# EAGLE design DeadHorsePCB_REV-A (EAGLE 8.3.1)
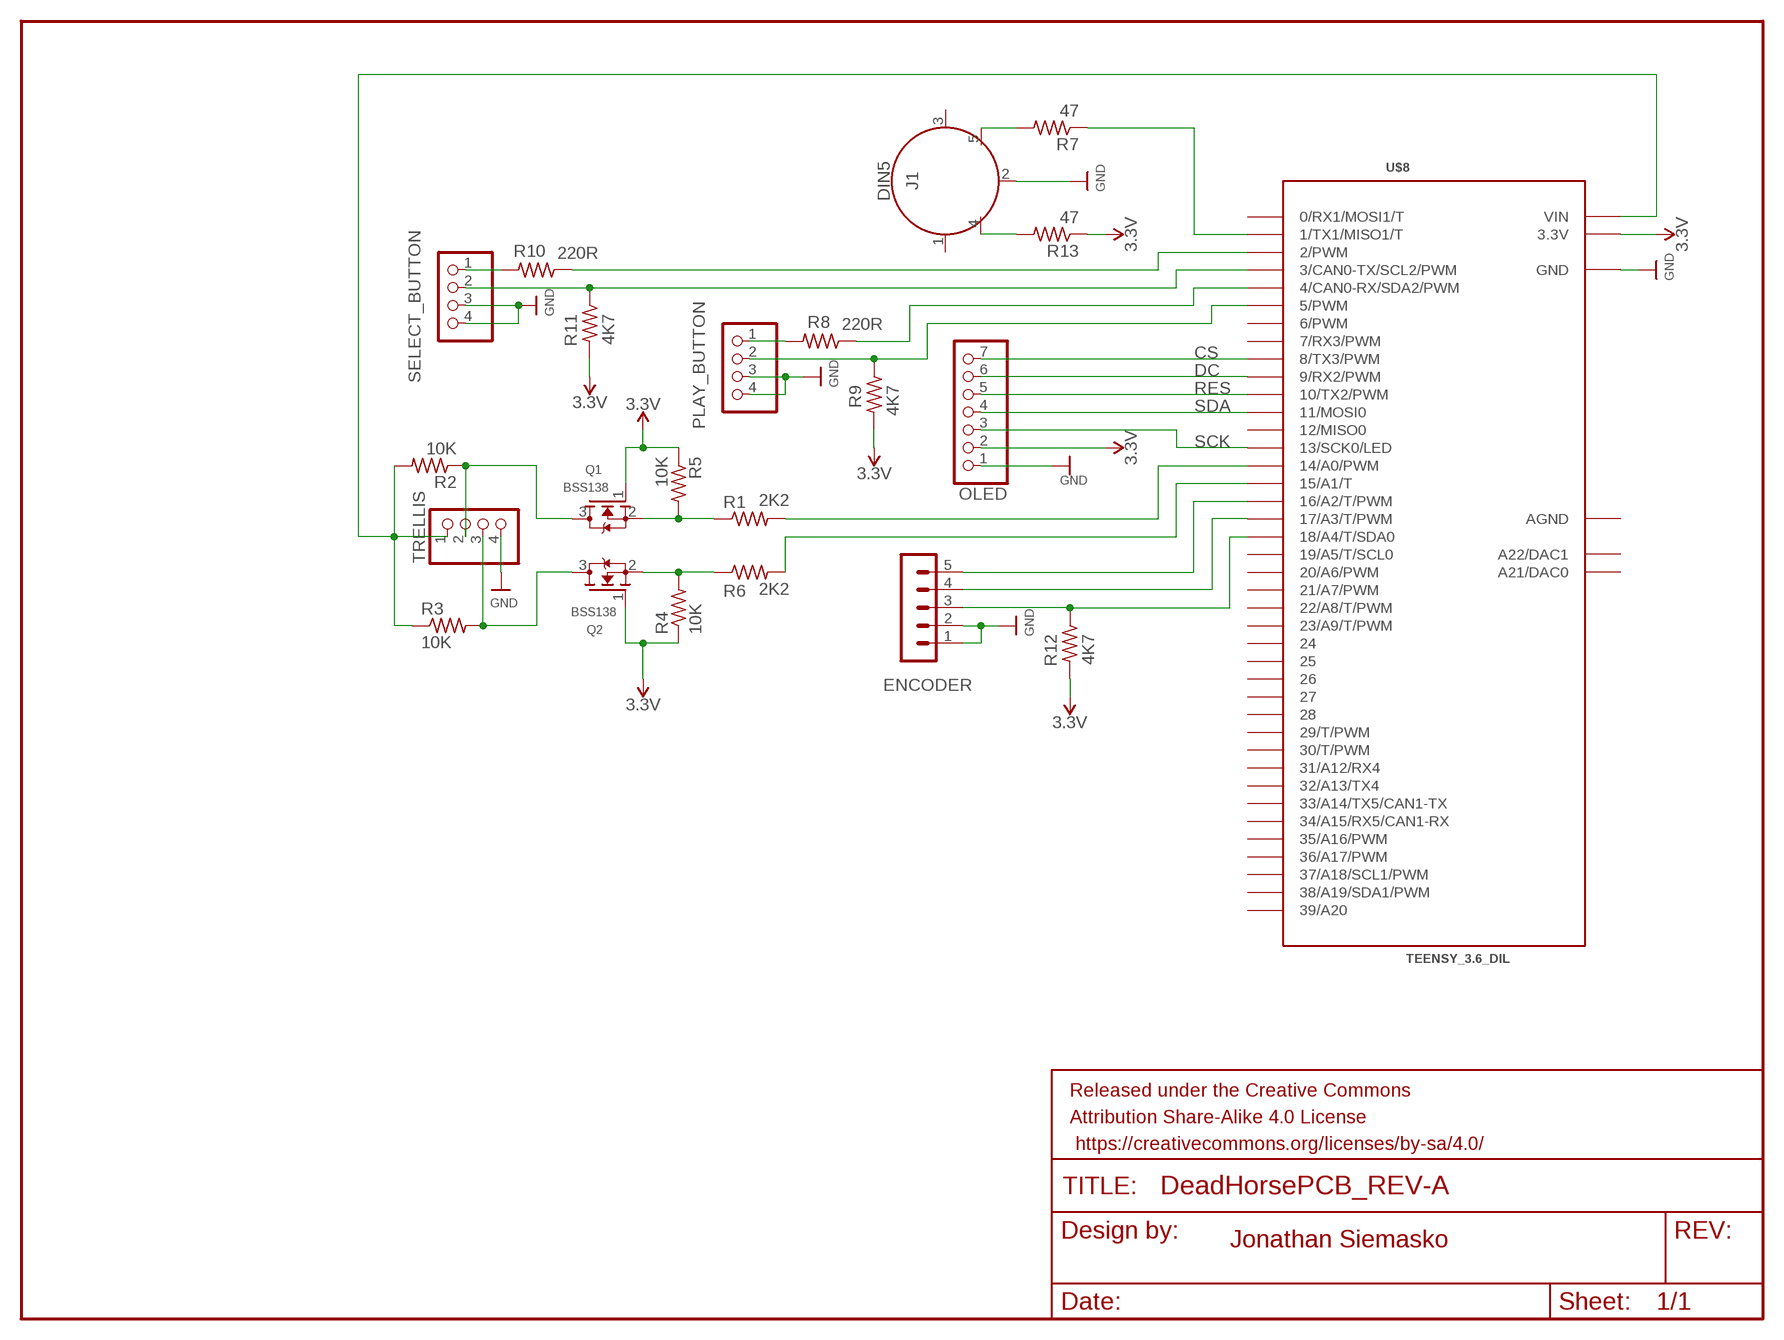
[diagram p0: schematic, sheet 1]

## Parts
ENCODER  ENCODER  MA05-1  [MA05-1]
FRAME1  FRAME-LETTER  [CREATIVE_COMMONS]
J1  DIN5  [DIN5-RA-PTH]
OLED  OLED  PINHD-1X7  [1X07]
PLAY_BUTTON  PlayBtn  PINHD-1X4  [1X04]
Q1  BSS138  MOSFET-NREFLOW  [SOT23]
Q2  BSS138  MOSFET-NREFLOW  [SOT23]
R1  2K2  R-US_R0805  [R0805]
R2  10K  R-US_R0805  [R0805]
R3  10K  R-US_R0805  [R0805]
R4  10K  R-US_R0805  [R0805]
R5  10K  R-US_R0805  [R0805]
R6  2K2  R-US_R0805  [R0805]
R7  47  R-US_R0805  [R0805]
R8  220R  R-US_R0805  [R0805]
R9  4K7  R-US_R0805  [R0805]
R10  220R  R-US_R0805  [R0805]
R11  4K7  R-US_R0805  [R0805]
R12  4K7  R-US_R0805  [R0805]
R13  47  R-US_R0805  [R0805]
SELECT_BUTTON  SelectBtn  PINHD-1X4  [1X04]
TRELLIS  TRELLIS  PINHD-1X4  [1X04]
U$8  TEENSY_3.6_DIL  [TEENSY_3.6_DIL]

## Nets
3.3V: OLED.2 Q1.1(G) Q2.1(G) R4.1 R5.1 R9.2 R11.2 R12.2 R13.1 U$8.3.3V U$8.3.3V3(3.3V)
CS: OLED.7 U$8.8(8/TX3/PWM)
DC: OLED.6 U$8.9(9/RX2/PWM)
GND [supply]: ENCODER.1 ENCODER.2 J1.2 OLED.1 PLAY_BUTTON.3 PLAY_BUTTON.4 SELECT_BUTTON.3 SELECT_BUTTON.4 TRELLIS.4 U$8.GND U$8.GND1(GND)
N$1: PLAY_BUTTON.1 R8.2
N$2: Q1.3(D) R2.1 TRELLIS.2
N$3: J1.4 R13.2
N$4: J1.5 R7.2
N$5: Q1.2(S) R1.1 R5.2
N$6: R1.2 U$8.14/A0(14/A0/PWM)
N$7: R6.2 U$8.15/A1(15/A1/T)
N$8: Q2.3(D) R3.2 TRELLIS.3
N$9: ENCODER.4 U$8.17/A3(17/A3/T/PWM)
N$10: ENCODER.5 U$8.16/A2(16/A2/T/PWM)
N$12: Q2.2(S) R4.2 R6.1
N$13: R8.1 U$8.4(4/CAN0-RX/SDA2/PWM)
N$14: PLAY_BUTTON.2 R9.1 U$8.5(5/PWM)
N$16: R10.1 U$8.2(2/PWM)
N$18: R10.2 SELECT_BUTTON.1
N$20: ENCODER.3 R12.1 U$8.18/A4(18/A4/T/SDA0)
N$21: R7.1 U$8.1(1/TX1/MISO1/T)
N$22: R11.1 SELECT_BUTTON.2 U$8.3(3/CAN0-TX/SCL2/PWM)
RES: OLED.5 U$8.10(10/TX2/PWM)
SCK: OLED.3 U$8.13(13/SCK0/LED)
SDA: OLED.4 U$8.11(11/MOSI0)
VIN [5v supply]: R2.2 R3.1 TRELLIS.1 U$8.VIN
Unconnected: J1.1 J1.3 U$8.0(0/RX1/MOSI1/T) U$8.6(6/PWM) U$8.7(7/RX3/PWM) U$8.12(12/MISO0) U$8.19/A5(19/A5/T/SCL0) U$8.20/A6(20/A6/PWM) U$8.21/A7(21/A7/PWM) U$8.22/A8(22/A8/T/PWM) U$8.23/A9(23/A9/T/PWM) U$8.24 U$8.25 U$8.26 U$8.27 U$8.28 U$8.29(29/T/PWM) U$8.30(30/T/PWM) U$8.31/A12(31/A12/RX4) U$8.32/A13(32/A13/TX4) U$8.33/A14(33/A14/TX5/CAN1-TX) U$8.34/A15(34/A15/RX5/CAN1-RX) U$8.35/A16(35/A16/PWM) U$8.36/A17(36/A17/PWM) U$8.37/A18(37/A18/SCL1/PWM) U$8.38/A19(38/A19/SDA1/PWM) U$8.39/A20 U$8.A21(A21/DAC0) U$8.A22(A22/DAC1)

## Notes on the sheet
- Jonathan Siemasko

## Power pins joined to a net without a drawn wire
AGND: U$8.AGND

## Library data of the parts
ENCODER = con-lstb:MA05-1: PIN HEADER; OC_FARNELL: unknown; OC_NEWARK: unknown
FRAME1 = SparkFun-Aesthetics:FRAME-LETTER: Schematic Frame - Letter Standard 8.5x11 US Letter frame
J1 = SparkFun-Connectors:DIN5: DIN5 Connector - Female Right Angle (frequently used as a MIDI Jack connector) This type of connector and cable is frequently used for transmitting midi data (musical instrument digital interface). It is what you usually see on a keyboard or set of electronic drums. Learn more here <https://en.wikipedia.org/wiki/MIDI>. For more information on the pinout and electrical specifications of MIDI communications, please see the following resource: https://www.midi.org/specifications/item/midi-din-electrical-specification Here is the connector we sell at SparkFun: MIDI Connector - Female Right Angle <https://www.sparkfun.com/products/9536> (PRT-09536) Datasheet <hhttp://www.sparkfun.com/datasheets/Prototyping/Connectors/MIDI-RA.pdf> It is used on this SparkFun product: SparkFun MIDI Shield <https://www.sparkfun.com/products/12898> (DEV-12898); PROD_ID: CONN-09481
OLED = pinhead:PINHD-1X7: PIN HEADER
PLAY_BUTTON SELECT_BUTTON TRELLIS = pinhead:PINHD-1X4: PIN HEADER
Q1 Q2 = adafruit:MOSFET-N: N-Channel Mosfet 2N7002E - 60V 260mA SOT23 [Digikey: 2N7002ET1GOSTR-ND] - REEL BSH103 - 30V 850mA SOT23 [Digikey: 568-5013-1-ND]
R1-R13 = adafruit:R-US_: RESISTOR, American symbol
U$8 = Teensy_3_and_LC_Series_Boards_v1.4:TEENSY_3.6_DIL: Teensy 3.6 DIL Package

## Board
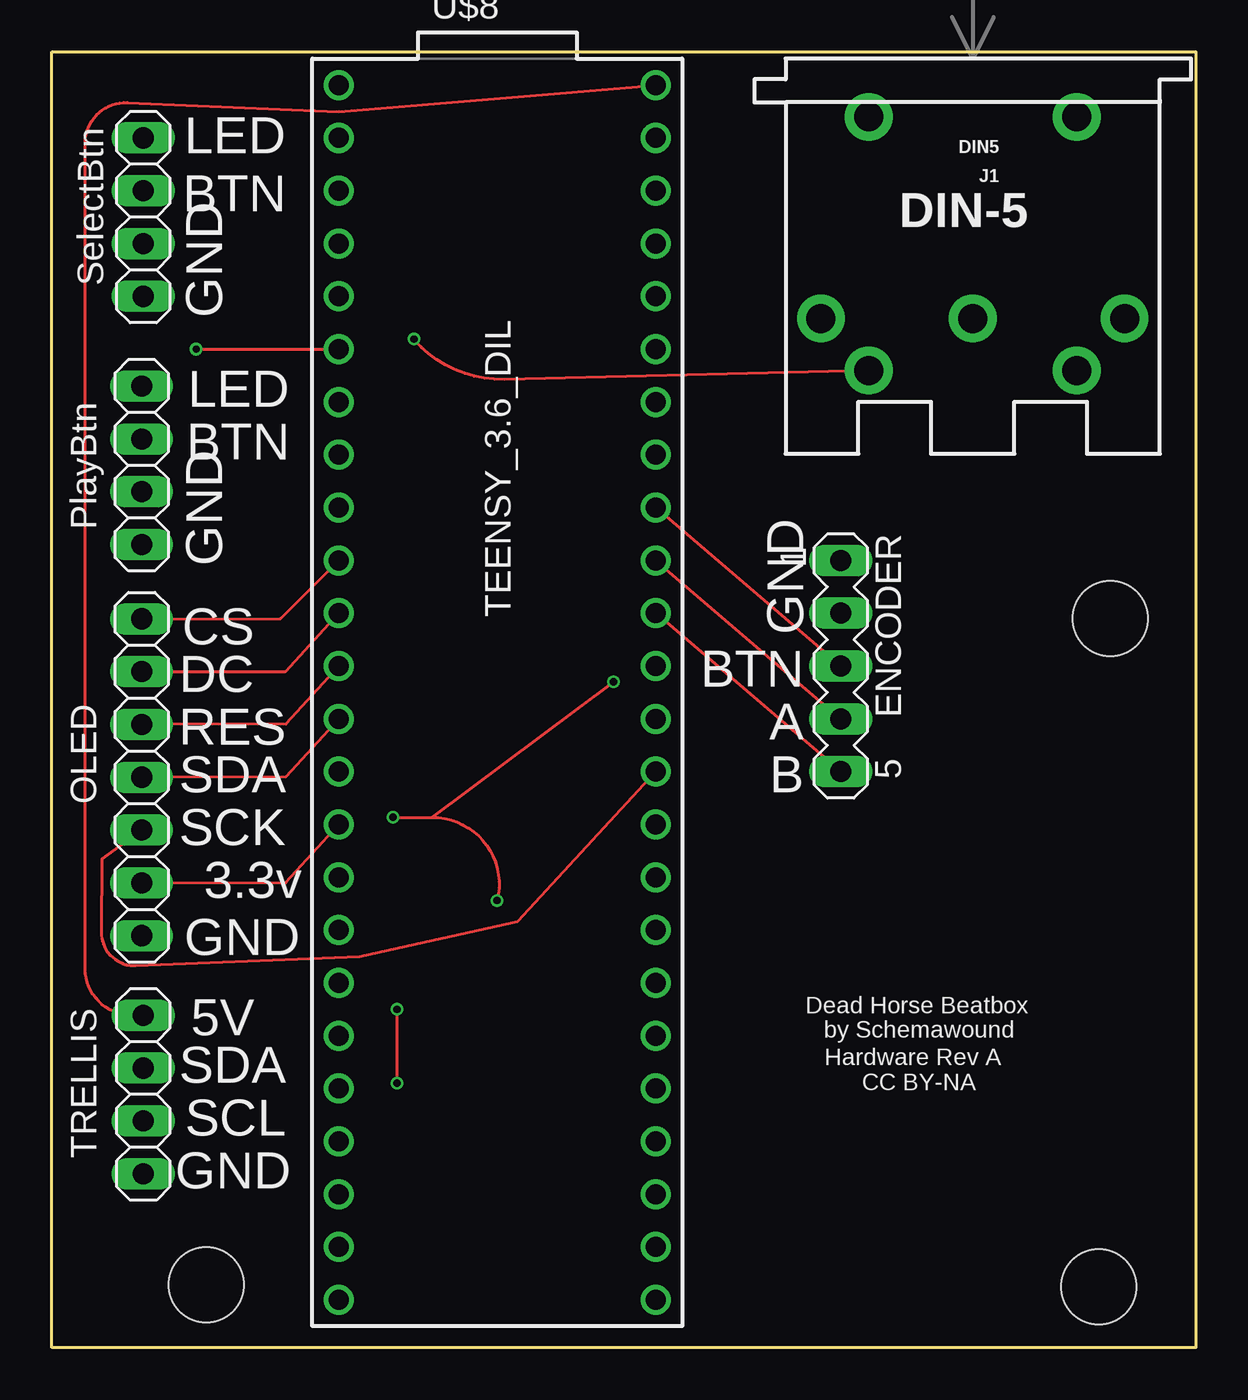
[diagram p1: board, top side]
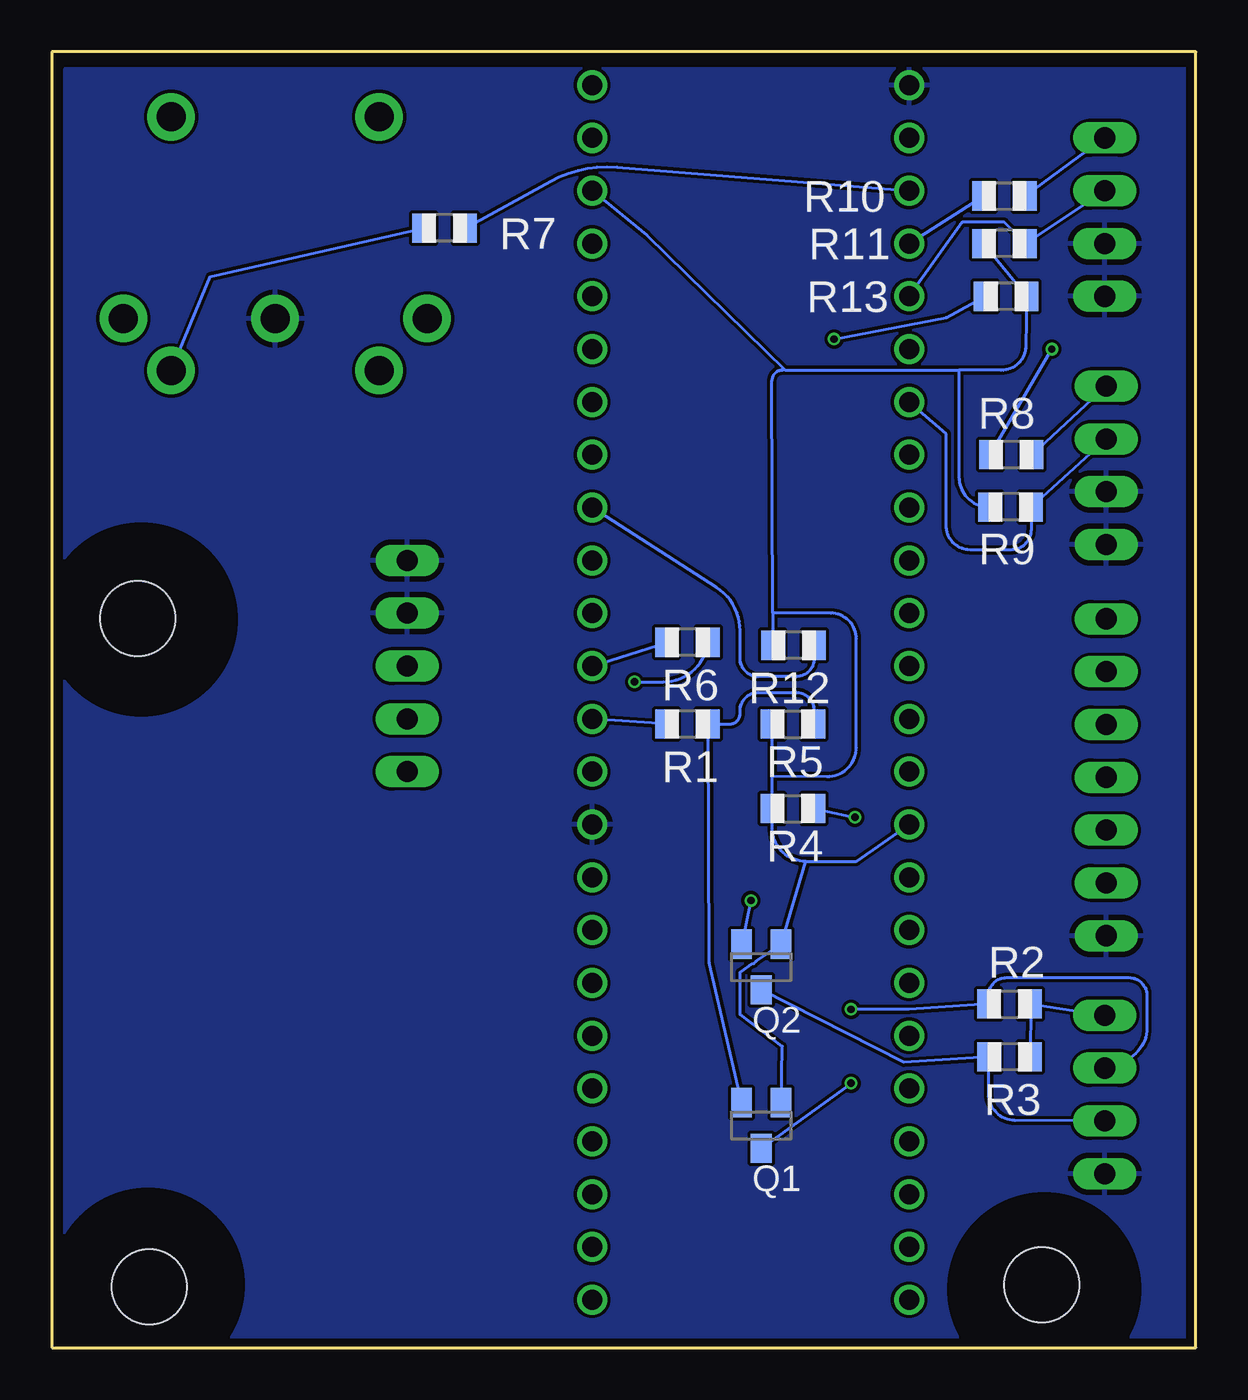
[diagram p2: board, bottom side, seen from below]

Size 55 x 62.31 mm. Coordinates in mm from the lower left corner, seen from the top.
Outline: 0,62.31 55,62.31 55,0 0,0 0,62.31
Copper layers (1*16): Top 0.035559375mm / dielectric 1.6mm / Bottom 0.035559375mm
Design rules "oshpark-2layer": minimum track width 6mil, minimum drill 10mil, track to track 6mil, track to pad 6mil, pad to pad 6mil, via to via 6mil, smd to smd 6mil, copper to edge 15mil, drill to drill 6mil, minimum pad ring 5mil, minimum via ring 5mil, stop-mask expansion 2.5mil, vias tented up to drill 0mil, thermal gap 10mil
Holes 3.6 mm at 7.42,3.02 50.87,35.06 50.33,2.91
bRestrict: area 2.7,-1.8 to 11.9,7.4; area 45.8,-1.6 to 55,7.6; area 46.1,30.4 to 55.3,39.6

### Footprints (pad centres in the part's own frame; a part is rotated, then mirrored left to right if it is on the bottom)
MA05-1 = drill 1.016 long: 1 -5.08,0; 2 -2.54,0; 3 0,0; 4 2.54,0; 5 5.08,0
DIN5-RA-PTH = drill 1.4 pad 2.286: 1 7.3,12.5; 2 0,12.5; 3 -7.3,12.5; 4 5,15; 5 -5,15; 6 -5,2.8; 7 5,2.8
1X07 = drill 1.016 long: 1 -7.62,0; 2 -5.08,0; 3 -2.54,0; 4 0,0; 5 2.54,0; 6 5.08,0; 7 7.62,0
1X04 = drill 1.016 long: 1 -3.81,0; 2 -1.27,0; 3 1.27,0; 4 3.81,0
SOT23 = smd 1 x 1.4: 1 -0.95,-1.1; 2 0.95,-1.1; 3 0,1.1
R0805 = smd 1.1 x 1.4: 1 -1,0; 2 1,0
TEENSY_3.6_DIL = drill 0.965: 0 -7.62,25.4; 1 -7.62,22.86; 2 -7.62,20.32; 3 -7.62,17.78; 3.3V 7.62,22.86; 3.3V3 -7.62,-7.62; 4 -7.62,15.24; 5 -7.62,12.7; 6 -7.62,10.16; 7 -7.62,7.62; 8 -7.62,5.08; 9 -7.62,2.54; 10 -7.62,0; 11 -7.62,-2.54; 12 -7.62,-5.08; 13 7.62,-5.08; 14/A0 7.62,-2.54; 15/A1 7.62,0; 16/A2 7.62,2.54; 17/A3 7.62,5.08; 18/A4 7.62,7.62; 19/A5 7.62,10.16; 20/A6 7.62,12.7; 21/A7 7.62,15.24; 22/A8 7.62,17.78; 23/A9 7.62,20.32; 24 -7.62,-10.16; 25 -7.62,-12.7; 26 -7.62,-15.24; 27 -7.62,-17.78; 28 -7.62,-20.32; 29 -7.62,-22.86; 30 -7.62,-25.4; 31/A12 -7.62,-27.94; 32/A13 -7.62,-30.48; 33/A14 7.62,-30.48; 34/A15 7.62,-27.94; 35/A16 7.62,-25.4; 36/A17 7.62,-22.86; 37/A18 7.62,-20.32; 38/A19 7.62,-17.78; 39/A20 7.62,-15.24; A21 7.62,-12.7; A22 7.62,-10.16; AGND 7.62,25.4; GND -7.62,27.94; GND1 7.62,-7.62; VIN 7.62,27.94

### Placement (x,y rotation side)
ENCODER  37.92,32.78 270 top
FRAME1  -18.47,-30.47 0 top  (outside the outline)
J1  44.27,61.99 180 top
OLED  4.31,27.43 90 top
PLAY_BUTTON  4.31,42.43 270 top
Q1  20.9,10.68 180 bottom
Q2  20.9,18.3 180 bottom
R1  24.46,29.98 180 bottom
R2  8.96,16.52 0 bottom
R3  8.96,13.98 180 bottom
R4  19.38,25.92 0 bottom
R5  19.38,29.98 0 bottom
R6  24.46,33.92 180 bottom
R7  36.14,53.84 180 bottom
R8  8.88,42.95 0 bottom
R9  8.91,40.43 180 bottom
R10  9.22,55.38 0 bottom
R11  9.22,53.1 180 bottom
R12  19.35,33.78 180 bottom
R13  9.14,50.56 180 bottom
SELECT_BUTTON  4.39,54.37 270 top
TRELLIS  4.39,12.17 270 top
U$8  21.41,32.78 0 top

### Tracks (layer width: path | path; a pad name or v marks a point on that pad's centre or on a via)
3.3V
  Top 0.152: OLED.2 11.25,22.36 U$8.3.3V3
  Bottom 0.152: R11.2 R13.1 8.18,48.17 arc89 9.37,47 11.4,47 | 19.75,47 11.4,47 | 19.75,47 19.89,47 arc-90 20.39,46.5 20.35,35.33 | 20.35,35.33 R12.2 | 11.4,47 11.4,41.87 arc-87 10.03,40.43 R9.2 | U$8.3.3V 26.4,53.5 19.75,47 | U$8.3.3V3 16.33,23.38 18.76,23.38 | 18.76,23.38 arc90 20.38,25.01 R4.1 20.38,27.5 | 18.76,23.38 Q2.1 21.16,18.56 21.25,18.47 21.3,18.47 21.92,18.04 21.92,16.01 19.88,14.49 Q1.1 | 20.38,27.5 R5.1 | 20.38,27.5 17.74,27.46 arc-91 16.33,28.86 16.33,34.08 arc-90 17.56,35.32 20.35,35.33
CS
  Top 0.152: OLED.7 10.99,35.06 U$8.8
DC
  Top 0.152: OLED.6 11.25,32.52 U$8.9
GND
  pour Bottom: 0.4,61.5 54.4,61.5 54.4,0.5 0.4,0.5
N$1
  Bottom 0.152: R8.2 PLAY_BUTTON.1
N$2  (via drill 0.35)
  Top 0.152: v16.58,16.27 v16.58,12.71
  Bottom 0.152: TRELLIS.2 3.42,13.82 arc-69 2.36,15.37 2.36,16.92 arc-90 3.23,17.79 9.12,17.79 arc-91 9.97,16.93 R2.1 13.79,16.27 v16.58,16.27 | v16.58,12.71 Q1.3
N$3  (via drill 0.35)
  Top 0.152: J1.4 21.77,46.56 arc-51 v17.4,48.5
  Bottom 0.152: v17.4,48.5 12.01,49.54 R13.2
N$4
  Bottom 0.152: J1.5 47.4,51.5 R7.2
N$5
  Bottom 0.152: Q1.2 23.4,18.5 R1.1 22.42,29.98 arc-90 21.92,30.49 21.92,30.64 arc90 21.05,31.51 19.22,31.51 arc91 18.37,30.65 R5.2
N$6
  Bottom 0.152: R1.2 U$8.14/A0
N$7
  Bottom 0.152: U$8.15/A1 R6.2
N$8
  Bottom 0.152: TRELLIS.3 8.7,10.93 arc90 9.97,12.21 R3.2 14.04,13.73 Q2.3
N$9
  Top 0.152: ENCODER.4 U$8.17/A3
N$10
  Top 0.152: U$8.16/A2 ENCODER.5
N$12  (via drill 0.35)
  Top 0.152: v16.4,25.5 18.28,25.5 | 18.28,25.5 arc-104 v21.4,21.5 | 18.28,25.5 v27,32.01
  Bottom 0.152: R4.2 v16.4,25.5 | v21.4,21.5 Q2.2 | v27,32.01 25.61,32.01 arc-83 R6.1
N$13  (via drill 0.35)
  Top 0.152: v6.93,48.02 U$8.4
  Bottom 0.152: R8.1 v6.93,48.02
N$14
  Bottom 0.152: PLAY_BUTTON.2 R9.1 7.93,39.31 arc89 8.89,38.36 10.86,38.36 arc90 12.01,39.52 12.01,43.95 U$8.5
N$16
  Bottom 0.152: R10.1 U$8.2
N$18
  Bottom 0.152: R10.2 SELECT_BUTTON.1
N$20
  Top 0.152: U$8.18/A4 ENCODER.3
  Bottom 0.152: R12.1 18.35,33.14 arc89 19.23,32.27 21.05,32.27 arc90 21.92,33.13 21.92,34.48 arc-57 23.04,36.55 U$8.18/A4
N$21
  Bottom 0.152: R7.1 31.02,56.09 arc33 27.85,56.77 U$8.1
N$22
  Bottom 0.152: SELECT_BUTTON.2 R11.1 9.22,54.11 11.25,54.11 U$8.3
RES
  Top 0.152: U$8.10 11.25,29.98 OLED.5
SCK
  Top 0.152: OLED.3 2.4,23.5 2.37,19.97 arc93 4.03,18.37 14.8,18.81 22.4,20.5 U$8.13
SDA
  Top 0.152: U$8.11 11.25,27.44 OLED.4
VIN
  Top 0.152: TRELLIS.1 3.8,15.99 arc-89 1.6,18.21 1.6,57.92 arc-92 3.62,59.87 13.79,59.45 U$8.VIN
  Bottom 0.152: 7.93,16.52 R2.2 | 7.93,16.52 TRELLIS.1 | 7.93,16.52 R3.1

### Text on the board
tPlace: LED | BTN | GND | LED | BTN | GND | CS | GND | DC | BTN | RES | A | SDA | B | SCK | 3.3v | GND | 5V | Dead Horse Beatbox | SDA | by Schemawound | Hardware Rev A | CC BY-NA | SCL | GND